# Altium schematic sheet Zebra_Modem.SchDoc
size A
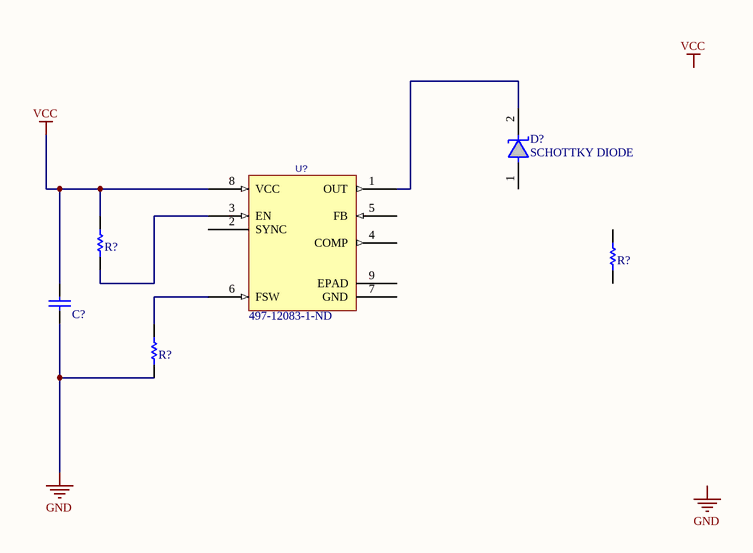
[diagram p0: Zebra_Modem.SchDoc]

## Parts
(Parts that share a designator on the sheet are numbered #1, #2 ... from top to bottom, then left to right.)
C?  CAP_1_21_3  [0402]  (value not drawn)
D?  SCHOTTKY DIODE  [SOD323]
R?#1  RES_13  [0603]  (value not drawn)
R?#2  RES_38  [0603]  (value not drawn)
R?#3  RES_11  [0603]  (value not drawn)
U?  Supplier Part Number 1: 497-12083-1-ND  [L7986ATR]  (hidden comment: L7986ATR)

## Nets
GND: C?.1 R?#3.2
VCC: C?.2 R?#1.1 U?.8(VCC)
NetD?_2: D?.2(K) U?.1(OUT)
NetR?#1_2: R?#1.2 U?.3(EN)
NetR?#3_1: R?#3.1 U?.6(FSW)

Not connected (* = marked no-connect by the designer): D? 1(A); R?#2 1 2; U? 2(SYNC) 4(COMP) 5(FB) 7(GND) 9(EPAD)

## Notes on the sheet
- Labels drawn without touching a wire or pin: GND, VCC

## Library data of the parts
C? = CAP_1_21_3: 1uF 10% 50V; Tolerance: 10%; Value: 1uF; Voltage: 50V
R?#1 = RES_13: RES 10K 1/16W 5% 0402; Power: *; Tolerance: *; Value: *
R?#2 = RES_38: RES 4.99K ±1% 0603 (1608); Power: *; Tolerance: *; Value: *
R?#3 = RES_11: RES 100K 0.1W ±1% 0603 (1608 Metric); Power: *; Tolerance: *; Value: *
U? = L7986ATR: IC Switching Regulator 3A STEP-DOWN 8-HSOP; Title: L7986TATR; Supplier 1: Digi-Key